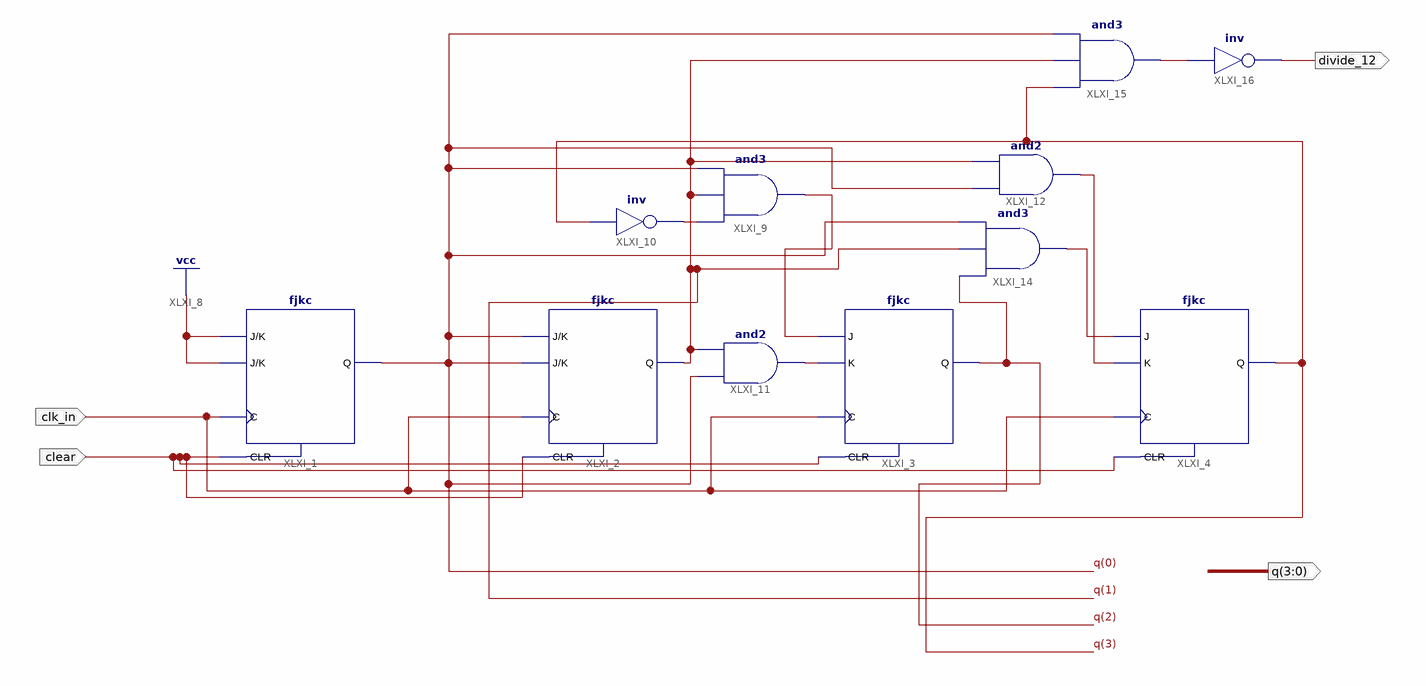
[diagram p0: schematic sheet 1]
// Xilinx ISE schematic counter011.sch (spartan6) as structural Verilog: 11 symbols, 5 ports
module counter011 (
  input  clk_in,
  input  clear,
  output XLXN_20,
  output [3:0] q,
  output divide_12
);

  wire XLXN_4, XLXN_9, XLXN_10, XLXN_12, XLXN_14;

  fjkc XLXI_4 (.C(clk_in), .CLR(clear), .J(XLXN_14), .K(XLXN_12), .Q(q[3]));
  fjkc XLXI_1 (.C(clk_in), .CLR(clear), .J(1'b1), .K(1'b1), .Q(q[0]));
  fjkc XLXI_2 (.C(clk_in), .CLR(clear), .J(q[0]), .K(q[0]), .Q(q[1]));
  fjkc XLXI_3 (.C(clk_in), .CLR(clear), .J(XLXN_9), .K(XLXN_10), .Q(q[2]));
  and XLXI_9 (XLXN_9, XLXN_4, q[1], q[0]);
  not XLXI_10 (XLXN_4, q[3]);
  and XLXI_11 (XLXN_10, q[0], q[1]);
  and XLXI_12 (XLXN_12, q[0], q[1]);
  and XLXI_14 (XLXN_14, q[2], q[1], q[0]);
  and XLXI_15 (XLXN_20, q[3], q[1], q[0]);
  not XLXI_16 (divide_12, XLXN_20);
endmodule
